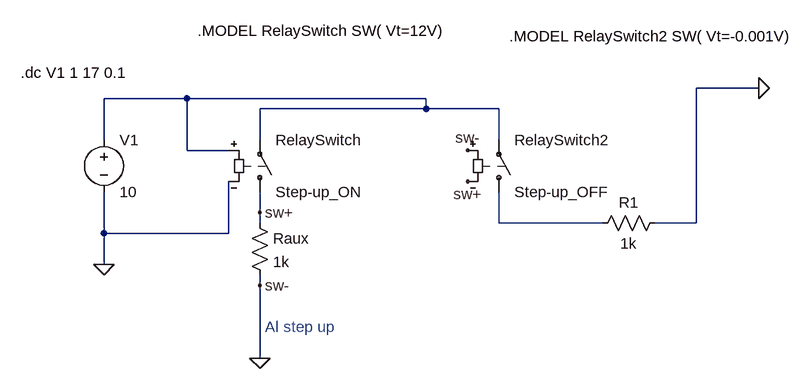
[diagram p0: schematic rele.asc]
rele.asc, the LTspice schematic file:
Version 4
SHEET 1 2196 680
WIRE 704 -64 608 -64
WIRE -176 -48 -304 -48
WIRE 192 -48 -176 -48
WIRE 192 -32 192 -48
WIRE 192 -32 -64 -32
WIRE 304 -32 192 -32
WIRE -304 16 -304 -48
WIRE -64 16 -64 -32
WIRE 304 16 304 -32
WIRE -176 32 -176 -48
WIRE -112 32 -176 32
WIRE -64 128 -64 96
WIRE -64 144 -64 128
WIRE 304 144 304 96
WIRE 464 144 304 144
WIRE 608 144 608 -64
WIRE 608 144 544 144
WIRE -304 160 -304 96
WIRE -112 160 -112 80
WIRE -112 160 -304 160
WIRE -304 208 -304 160
WIRE -64 240 -64 224
WIRE -64 352 -64 240
FLAG -304 208 0
FLAG 256 80 sw+
FLAG -64 128 sw+
FLAG 256 32 sw-
FLAG -64 240 sw-
FLAG -64 352 0
FLAG 704 -64 0
SYMBOL sw -64 112 M180
SYMATTR InstName Step-up_ON
SYMATTR Value RelaySwitch
SYMBOL sw 304 112 M180
SYMATTR InstName Step-up_OFF
SYMATTR Value RelaySwitch2
SYMBOL voltage -304 0 R0
WINDOW 123 0 0 Left 0
WINDOW 39 0 0 Left 0
SYMATTR InstName V1
SYMATTR Value 10
SYMBOL res -80 128 R0
SYMATTR InstName Raux
SYMATTR Value 1k
SYMBOL res 560 128 R90
WINDOW 0 0 56 VBottom 2
WINDOW 3 32 56 VTop 2
SYMATTR InstName R1
SYMATTR Value 1k
TEXT -160 -152 Left 2 !.MODEL RelaySwitch SW( Vt=12V)
TEXT -432 -88 Left 2 !.dc V1 1 17 0.1
TEXT 320 -144 Left 2 !.MODEL RelaySwitch2 SW( Vt=-0.001V)
TEXT -56 304 Left 2 ;Al step up

The netlist it stands for:
* rele.asc
Step-up_ON sw+ N001 N001 0 RelaySwitch
Step-up_OFF N002 N001 0 sw+ RelaySwitch2
V1 N001 0 10
Raux sw+ 0 1k
R1 0 N002 1k
.MODEL RelaySwitch SW( Vt=12V)
.dc V1 1 17 0.1
.MODEL RelaySwitch2 SW( Vt=-0.001V)
* Al step up
.backanno
.end